# Altium schematic sheet GAPandPeripherals.SchDoc: PULP - shield - GAP
size A3; Revision: 1.1; SheetNumber: 1; SheetTotal: 2
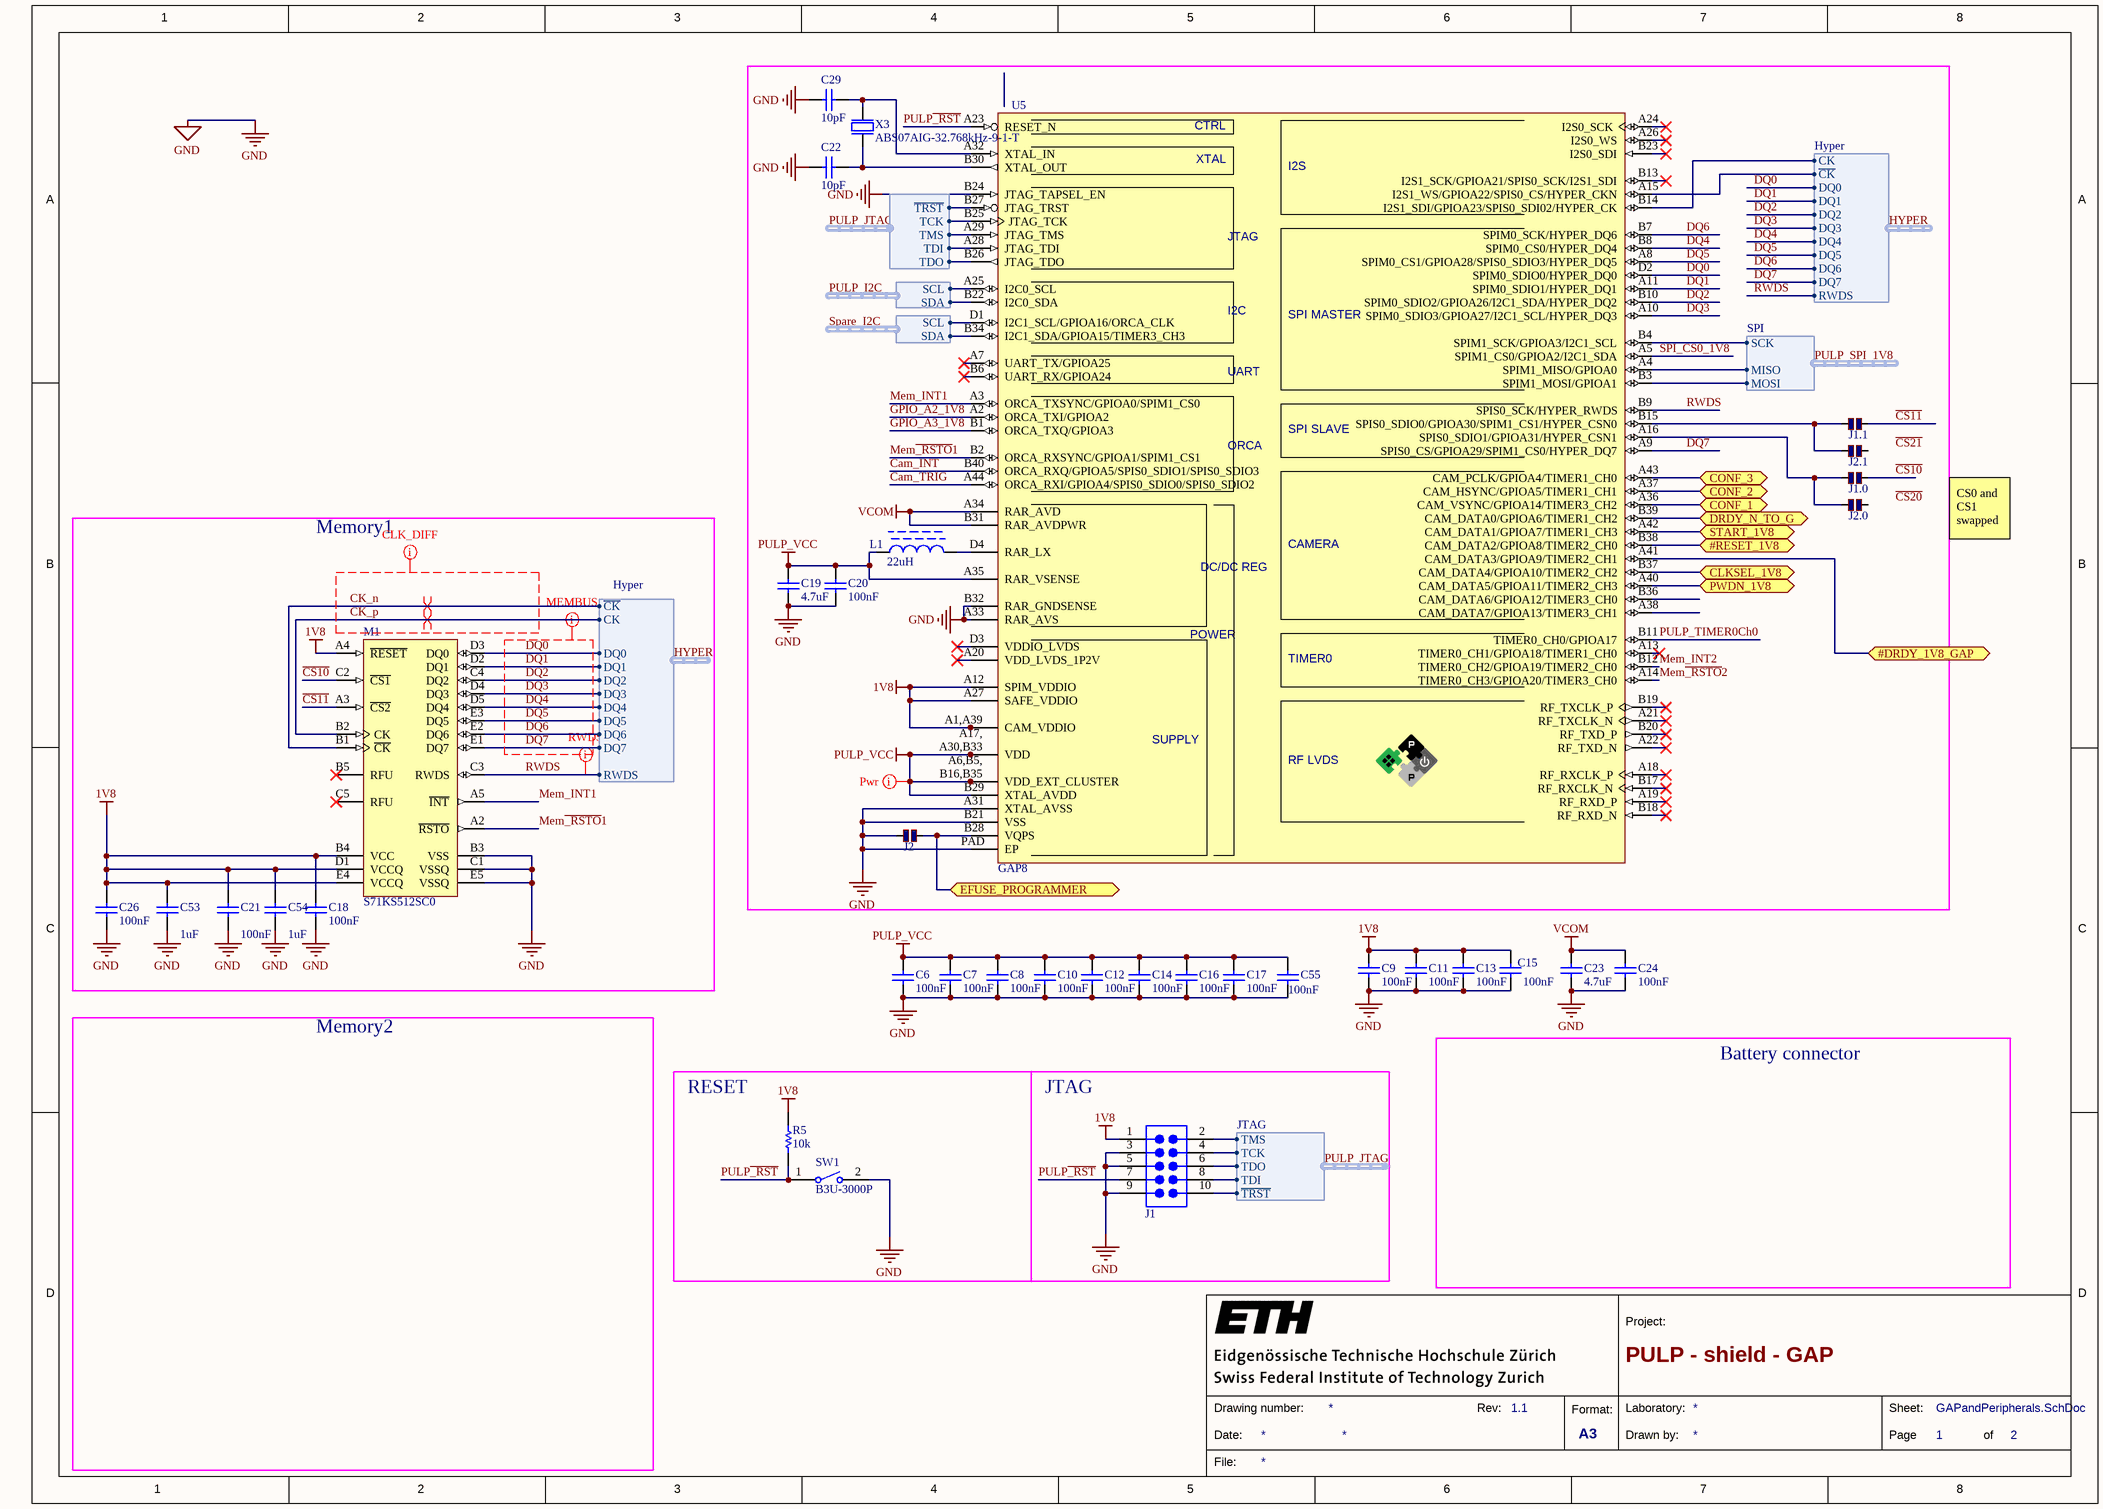
[diagram p0: GAPandPeripherals.SchDoc]

## Parts
C6  100nF  [CAPC0402(1005)60_N]
C7  100nF  [CAPC0402(1005)60_N]
C8  100nF  [CAPC0402(1005)60_N]
C9  100nF  [CAPC0402(1005)60_N]
C10  100nF  [CAPC0402(1005)60_N]
C11  100nF  [CAPC0402(1005)60_N]
C12  100nF  [CAPC0402(1005)60_N]
C13  100nF  [CAPC0402(1005)60_N]
C14  100nF  [CAPC0402(1005)60_N]
C15  100nF  [CAPC0402(1005)60_N]
C16  100nF  [CAPC0402(1005)60_N]
C17  100nF  [CAPC0402(1005)60_N]
C18  100nF  [CAPC0402(1005)60_N]
C19  4.7uF  [CAPC0402(1005)60_N]
C20  100nF  [CAPC0402(1005)60_N]
C21  value 100nF  [0402]  (hidden comment: Cap Semi)
C22  10pF  [CAPC0402(1005)60_L]
C23  4.7uF  [CAPC0402(1005)60_N]
C24  100nF  [CAPC0402(1005)60_N]
C26  100nF  [CAPC0402(1005)60_N]
C29  10pF  [CAPC0402(1005)60_L]
C53  value 1uF  [0402]  (hidden comment: Cap Semi)
C54  value 1uF  [0402]  (hidden comment: Cap Semi)
C55  value 100nF  [0402]  (hidden comment: Cap Semi)
J1  20021111-00010T4LF  [20021111-00010T4LF]  (value not drawn)
J1.0  Solder Jumper  [UJMPR]  (value not drawn)
J1.1  Solder Jumper  [UJMPR]  (value not drawn)
J2  Solder Jumper  [Small Solder Jumper 2]  (value not drawn)
J2.0  Solder Jumper  [UJMPR]  (value not drawn)
J2.1  Solder Jumper  [UJMPR]  (value not drawn)
L1  value 22uH  [SRN4026]  (hidden comment: SRN4026-220M)
M1  S71KS512SC0  [FBGA24_A-130]
R5  10k  [RESC1005X40X25NL05T05]
SW1  B3U-3000P  [OMRON-B3U-3000P_V]
U5  GAP8  [RKC0088A_V]
X3  ABS07AIG-32.768kHz-9-1-T  [ABRA-ABS07-2_V]

## Blocks framed on the sheet
Memory1: C18 C21 C26 C53 C54 M1
RESET: R5 SW1
JTAG: J1

## Ports
#DRDY_1V8_GAP, #RESET_1V8, CLKSEL_1V8, CONF_1, CONF_2, CONF_3, DRDY_N_TO_G, EFUSE_PROGRAMMER, PWDN_1V8, START_1V8

## Harnesses
Hyper: CK, ~{CK}, DQ0, DQ1, DQ2, DQ3, DQ4, DQ5, DQ6, DQ7, RWDS
JTAG: ~{TRST}, TMS, TDO, TDI, TCK
I2C: SDA, SCL
SPI: SCK, MISO, MOSI

## Nets
1V8: C9.2 C11.2 C13.2 C15.2 C18.2 C21.2 C26.2 C53.2 C54.2 J1.1 M1.A4(~{RESET}) M1.B4(VCC) M1.D1(VCCQ) M1.E4(VCCQ) R5.2 U5.A1(CAM_VDDIO) U5.A12(SPIM_VDDIO) U5.A27(SAFE_VDDIO) U5.A39(CAM_VDDIO)
GND: C6.1 C7.1 C8.1 C9.1 C10.1 C11.1 C12.1 C13.1 C14.1 C15.1 C16.1 C17.1 C18.1 C19.1 C20.1 C21.1 C22.1 C23.1 C24.1 C26.1 C29.1 C53.1 C54.1 C55.1 J1.3 J1.5 J1.9 J2.2 M1.B3(VSS) M1.C1(VSSQ) M1.E5(VSSQ) SW1.2 U5.A31(XTAL_AVSS) U5.A33(RAR_AVS) U5.B21(VSS) U5.B24(JTAG_TAPSEL_EN) U5.B32(RAR_GNDSENSE) U5.PAD(EP)
PULP_VCC: C6.2 C7.2 C8.2 C10.2 C12.2 C14.2 C16.2 C17.2 C19.2 C20.2 C55.2 L1.1 U5.A6(VDD_EXT_CLUSTER) U5.A17(VDD) U5.A30(VDD) U5.A35(RAR_VSENSE) U5.B5(VDD_EXT_CLUSTER) U5.B16(VDD_EXT_CLUSTER) U5.B29(XTAL_AVDD) U5.B33(VDD) U5.B35(VDD_EXT_CLUSTER)
VCOM: C23.2 C24.2 U5.A34(RAR_AVD) U5.B31(RAR_AVDPWR)
#DRDY_1V8_GAP: U5.A41(CAM_DATA3/GPIOA9/TIMER2_CH1) ; port #DRDY_1V8_GAP
#RESET_1V8: U5.B38(CAM_DATA2/GPIOA8/TIMER2_CH0) ; port #RESET_1V8
~{CS10}: J1.0.2 M1.C2(~{CS1})
~{CS11}: J1.1.2 M1.A3(~{CS2})
Cam_INT: U5.B40(ORCA_RXQ/GPIOA5/SPIS0_SDIO1/SPIS0_SDIO3)
Cam_TRIG: U5.A44(ORCA_RXI/GPIOA4/SPIS0_SDIO0/SPIS0_SDIO2)
CK_n: M1.B1(~{CK}) U5.A15(I2S1_WS/GPIOA22/SPIS0_CS/HYPER_CKN) ; harness Hyper.~{CK}
CK_p: M1.B2(CK) U5.B14(I2S1_SDI/GPIOA23/SPIS0_SDI02/HYPER_CK) ; harness Hyper.CK
CLKSEL_1V8: U5.B37(CAM_DATA4/GPIOA10/TIMER2_CH2) ; port CLKSEL_1V8
CONF_1: U5.A36(CAM_VSYNC/GPIOA14/TIMER3_CH2) ; port CONF_1
CONF_2: U5.A37(CAM_HSYNC/GPIOA5/TIMER1_CH1) ; port CONF_2
CONF_3: U5.A43(CAM_PCLK/GPIOA4/TIMER1_CH0) ; port CONF_3
DQ0: M1.D3(DQ0) U5.D2(SPIM0_SDIO0/HYPER_DQ0) ; harness Hyper.DQ0
DQ1: M1.D2(DQ1) U5.A11(SPIM0_SDIO1/HYPER_DQ1) ; harness Hyper.DQ1
DQ2: M1.C4(DQ2) U5.B10(SPIM0_SDIO2/GPIOA26/I2C1_SDA/HYPER_DQ2) ; harness Hyper.DQ2
DQ3: M1.D4(DQ3) U5.A10(SPIM0_SDIO3/GPIOA27/I2C1_SCL/HYPER_DQ3) ; harness Hyper.DQ3
DQ4: M1.D5(DQ4) U5.B8(SPIM0_CS0/HYPER_DQ4) ; harness Hyper.DQ4
DQ5: M1.E3(DQ5) U5.A8(SPIM0_CS1/GPIOA28/SPIS0_SDIO3/HYPER_DQ5) ; harness Hyper.DQ5
DQ6: M1.E2(DQ6) U5.B7(SPIM0_SCK/HYPER_DQ6) ; harness Hyper.DQ6
DQ7: M1.E1(DQ7) U5.A9(SPIS0_CS/GPIOA29/SPIM1_CS0/HYPER_DQ7) ; harness Hyper.DQ7
DRDY_N_TO_G: U5.B39(CAM_DATA0/GPIOA6/TIMER1_CH2) ; port DRDY_N_TO_G
EFUSE_PROGRAMMER: J2.1 U5.B28(VQPS) ; port EFUSE_PROGRAMMER
GPIO_A2_1V8: U5.A2(ORCA_TXI/GPIOA2)
GPIO_A3_1V8: U5.B1(ORCA_TXQ/GPIOA3)
Mem~{_RSTO}1: M1.A2(~{RSTO}) U5.B2(ORCA_RXSYNC/GPIOA1/SPIM1_CS1)
Mem~{_RSTO}2: U5.A14(TIMER0_CH3/GPIOA20/TIMER3_CH0)
Mem_INT1: M1.A5(~{INT}) U5.A3(ORCA_TXSYNC/GPIOA0/SPIM1_CS0)
Mem_INT2: U5.B12(TIMER0_CH2/GPIOA19/TIMER2_CH0)
PULP~{_RST}: J1.7 R5.1 SW1.1 U5.A23(RESET_N)
PULP_I2C.SCL: U5.A25(I2C0_SCL) ; harness I2C.SCL
PULP_I2C.SDA: U5.B22(I2C0_SDA) ; harness I2C.SDA
PULP_JTAG~{.TRST}: J1.10 U5.B27(JTAG_TRST) ; harness JTAG.~{TRST}
PULP_JTAG.TCK: J1.4 U5.B25(JTAG_TCK) ; harness JTAG.TCK
PULP_JTAG.TDI: J1.8 U5.A28(JTAG_TDI) ; harness JTAG.TDI
PULP_JTAG.TDO: J1.6 U5.B26(JTAG_TDO) ; harness JTAG.TDO
PULP_JTAG.TMS: J1.2 U5.A29(JTAG_TMS) ; harness JTAG.TMS
PULP_SPI_1V8.MISO: U5.A4(SPIM1_MISO/GPIOA0) ; harness SPI.MISO
PULP_SPI_1V8.MOSI: U5.B3(SPIM1_MOSI/GPIOA1) ; harness SPI.MOSI
PULP_SPI_1V8.SCK: U5.B4(SPIM1_SCK/GPIOA3/I2C1_SCL) ; harness SPI.SCK
PULP_TIMER0Ch0: U5.B11(TIMER0_CH0/GPIOA17)
PWDN_1V8: U5.A40(CAM_DATA5/GPIOA11/TIMER2_CH3) ; port PWDN_1V8
RWDS: M1.C3(RWDS) U5.B9(SPIS0_SCK/HYPER_RWDS) ; harness Hyper.RWDS  [project net HYPER.RWDS]
Spare_I2C.SCL: U5.D1(I2C1_SCL/GPIOA16/ORCA_CLK) ; harness I2C.SCL
Spare_I2C.SDA: U5.B34(I2C1_SDA/GPIOA15/TIMER3_CH3) ; harness I2C.SDA
SPI_CS0_1V8: U5.A5(SPIM1_CS0/GPIOA2/I2C1_SDA)
START_1V8: U5.A42(CAM_DATA1/GPIOA7/TIMER1_CH3) ; port START_1V8
NetC22_2: C22.2 U5.B30(XTAL_OUT) X3.1(inp)
NetC29_2: C29.2 U5.A32(XTAL_IN) X3.2(out)
NetJ1.0_1: J1.0.1 J2.0.1 U5.A16(SPIS0_SDIO1/GPIOA31/HYPER_CSN1)
NetJ1.1_1: J1.1.1 J2.1.1 U5.B15(SPIS0_SDIO0/GPIOA30/SPIM1_CS1/HYPER_CSN0)
NetL1_2: L1.2 U5.D4(RAR_LX)

Not connected (* = marked no-connect by the designer): J2.0 2; J2.1 2; M1 B5(RFU)* C5(RFU)*; U5 A7(UART_TX/GPIOA25)* A13(TIMER0_CH1/GPIOA18/TIMER1_CH0)* A18(RF_RXCLK_P)* A19(RF_RXD_P)* A20(VDD_LVDS_1P2V)* A21(RF_TXCLK_N)* A22(RF_TXD_N)* A24(I2S0_SCK)* A26(I2S0_WS)* A38(CAM_DATA7/GPIOA13/TIMER3_CH1) B6(UART_RX/GPIOA24)* B13(I2S1_SCK/GPIOA21/SPIS0_SCK/I2S1_SDI)* B17(RF_RXCLK_N)* B18(RF_RXD_N)* B19(RF_TXCLK_P)* B20(RF_TXD_P)* B23(I2S0_SDI)* B36(CAM_DATA6/GPIOA12/TIMER3_CH0) D3(VDDIO_LVDS)*

## Layout directives
differential pair: CK_n, CK_p
net class POWER: PULP_VCC
net class CLOCKDIFF: CK_n, CK_p
net class D0_7: DQ0, DQ1, DQ2, DQ3, DQ4, DQ5, DQ6, DQ7
net class RWDS_NET: HYPER.RWDS

## Notes on the sheet
- CS0 and CS1 swapped
- Memory2
- Battery connector
- Labels drawn without touching a wire or pin: ~{CS20}, ~{CS21}
- 1
- 2
- 3
- 4
- 5
- 6
- 7
- 8
- A
- B
- C
- D
- Project:
- Date:
- Drawing number:
- Rev:
- Format:
- A3
- Drawn by:
- Laboratory:
- Page
- Sheet:
- of
- File:
- (in symbol CMP-01034-2) CTRL; XTAL; I2S; JTAG; I2C; SPI MASTER; UART; ORCA; SPI SLAVE; CAMERA; DC/DC REG; POWER; TIMER0; A1,A39; A17,; SUPPLY; A30,B33; A6,B5,; RF LVDS; B16,B35

## Library data of the parts
C6-C18 C20 C24 C26 = CMP-1034-02065-1: CAP 100nF 10V ±10% 0402 (1005 Metric) Thickness 0.6mm SMD; Case-EIA: 0402; Case-Metric: 1005; Tolerance: Â±10%; Max Thickness: 0.6 mm; Value: 100nF; Rated Voltage: 10 V; Technology: SMT
C19 C23 = CMP-1034-02137-1: CAP 4.7uF 6.3V ±20% 0402 (1005 Metric) Thickness 0.6mm SMD; Case-Metric: 1005; Case-EIA: 0402; Tolerance: Â±20%; Technology: SMT; Max Thickness: 0.6 mm; Rated Voltage: 6.3 V; Value: 4.7uF
C21 C53-C55 = Cap Semi: Capacitor (Semiconductor SIM Model); Published: 8-Jun-2000; LatestRevisionDate: 29-May-2009; LatestRevisionNote: IPC-7351 Footprint Added.; PackageReference: C1206; Publisher: Altium Limited; PackageDescription: Chip Capacitor
C22 C29 = CMP-1034-00722-1: CAP 10pF 50V ±2% 0402 (1005 Metric) Thickness 0.6mm SMD; Tolerance: Â±2%; Case-Metric: 1005; Case-EIA: 0402; Technology: SMT; Value: 10pF; Max Thickness: 0.6 mm; Rated Voltage: 50 V
J1 = CON-5x2-Male: CONN HEADER VERT 10POS 1.27MM; Number of Contacts: 10; Insulation Resistance: 100MR; Current Rating: 10A; Voltage Rating: 125V; Contact Resistance: 30mR; Gender: Male; Row Spacing: 0.05inch; Stack Height: 2.5mm; Connector Type: Male Pin,Header; Contact Post Length: 2.3mm; Orientation: Straight; Lead Free: Lead Free; Max Operating Temperature: 85°C; Housing Material: Plastic; Package Quantity: 93; Packaging: Rail/Tube; Radiation Hardening: No; Contact Mating Length: 0.12inch; Mount: Through Hole; Max Voltage Rating (AC): 125V; Housing Color: Black; Contact Plating: Gold; Pitch: 1.27mm; Color: Black; Length: 6.35mm; Number of Positions: 10; Min Operating Temperature: -40°C; REACH SVHC: No SVHC; Termination: Solder; Number of Rows: 2; Contact Material: Nickel,Copper,Copper Alloy,Gold; Depth: 3.4mm
J1.0 J1.1 J2 J2.0 J2.1 = Solder Jumper: Value: 1; Technology: SMT
L1 = CMP-00905-1: Inductor Power Semi-Shielded Wirewound 22uH 20% 100KHz 11Q-Factor Ferrite 670mA 234mOhm DCR 1515 T/R; DC Resistance (DCR): 234mR; Self Resonant Frequency: 16MHz; Mount: Surface Mount; Case/Package: Nonstandard; Weight: 0.004938oz; Core Material: Ferrite; Min Operating Temperature: -40°C; Max Operating Temperature: 125°C; Packaging: Tape and Reel; Tolerance: 20%; Composition: Wirewound; Inductance: 22uh; Current Rating: 670mA; Saturation Current: 670mA; Shielding: Shielded; Test Frequency: 100kHz; Max DC Current: 670mA; Termination: SMD/SMT; RMS Current (Irms): 670mA; Inductance Tolerance: 20%; Package Quantity: 3000; Length: 4mm; Height: 2.5mm; Width: 4mm; Height - Seated (Max): 0.098inch; Depth: 4mm; REACH SVHC: No SVHC
M1 = CMP-00514-2: IC 512MB FLASH 64MB DRAM 24FBGA; Manufacturer: Cypress Semiconductor Corp; Memory Format: FLASH, RAM; Memory Type: Non-Volatile; Memory Size: 512Mbit Flash, 64Mbit RAM; Speed: 100MHz; Interface: Parallel, Serial; Voltage - Supply: 1.8V; Series: HyperFlash™ + HyperRAM™ KS; Package / Case: 24-VBGA; Supplier Device Package: 24-FBGA(6x8)
R5 = CMP-2002-00607-3: Chip Resistor, 10 KOhm, +/- 1%, 100 mW, -55 to 155 degC, 0402 (1005 Metric), RoHS, Tape and Reel; Manufacturer: Basic Passives; PartNumber: ERJ-2RKF1002X; Case\/Package: 0402; Resistance: 10 KOhm; Voltage Rating: 50 V; Power Rating: 100 mW; Packaging: Tape and Reel; Width: 0.5 mm; Package Quantity: 10000; Radiation Hardening: No; Min Operating Temperature: -55 degC; Case Code (Imperial): 0402; REACH SVHC: Yes; PackageDescription: 2-Pin Surface Mount Device, Body 1 x 0.5 mm; Length: 1 mm; ComponentLink1Description: Manufacturer URL; PackageReference: 0402; RoHSCompliant: true; ComponentLink1URL: http://www.panasonic.com/; Height: 0.35 mm; ComponentLink2Description: Datasheet; DatasheetVersion: 04/2015; Mounting Technology: Surface Mount; ComponentLink2URL: http://industrial.panasonic.com/cdbs/www-data/pdf/RDA0000/AOA0000C86.pdf; Max Operating Temperature: 155 degC; Pins: 2; Tolerance: 1%; Case Code (Metric): 1005; Mount: Surface Mount
SW1 = CMP-1677-00003-1: Ultra-Small Tactile Switch, 1 to 50 mA, 3 to 12 V, -25 to 70 degC, 2-Pin SMD, RoHS, Tape and Reel; Tolerance: 20%; Voltage Rating (DC): 50 V; Capacitance: 470 uF; Case\Package: Radial; PackageReference: B3U-3000P; Min Operating Temperature: -40 degC; Length: 20 mm; Mount: Through Hole; ComponentLink2Description: Datasheet; RoHSCompliant: true; ComponentLink1URL: http://www.omron.com/; Package Quantity: 200; Radiation Hardening: No; Height: 20 mm; ComponentLink2URL: https://www.omron.com/ecb/products/pdf/en-b3u.pdf; Diameter: 10 mm; Max Operating Temperature: 85 degC; Lead Pitch: 5 mm; DatasheetVersion: Jan-15; Packaging: Bulk; PackageDescription: 2-Pin Surface Mount Device, Body 4 x 3.2 mm; Voltage Rating: 50 V; Pins: 2; ComponentLink1Description: Manufacturer URL; REACH SVHC: No SVHC
U5 = CMP-01034-2: Package: QFN88
X3 = XTAL_2-pin: XTAL SMD 3215, 32.768kHz, Cl=9pF, Total Tol: ±50ppm; Part Number: XTAL_SMD3215_32.768kHz_9pF_General; Note: XTAL SMD 32.768kHz; Artikkelnr Noca: N.A.; Manufacturer: *; Manufacturer Part Number: *; Datasheet: *; LatestRevisionDate: 2016-08-19; Pin Count: 2; Publisher: Nordic Semiconductor; Published: 2016-08-19; Value: 32.768kHz; Supplier: *; Supplier part number: *; 2nd source Supplier: *; 2nd source part number: *; Footprint Doc: XTAL_3215; Artikkelnr Simpro: N.A.